# Altium schematic sheet User_Interface.SchDoc: User Interface
size A4; DocumentNumber: 14; SheetNumber: 14; SheetTotal: 51
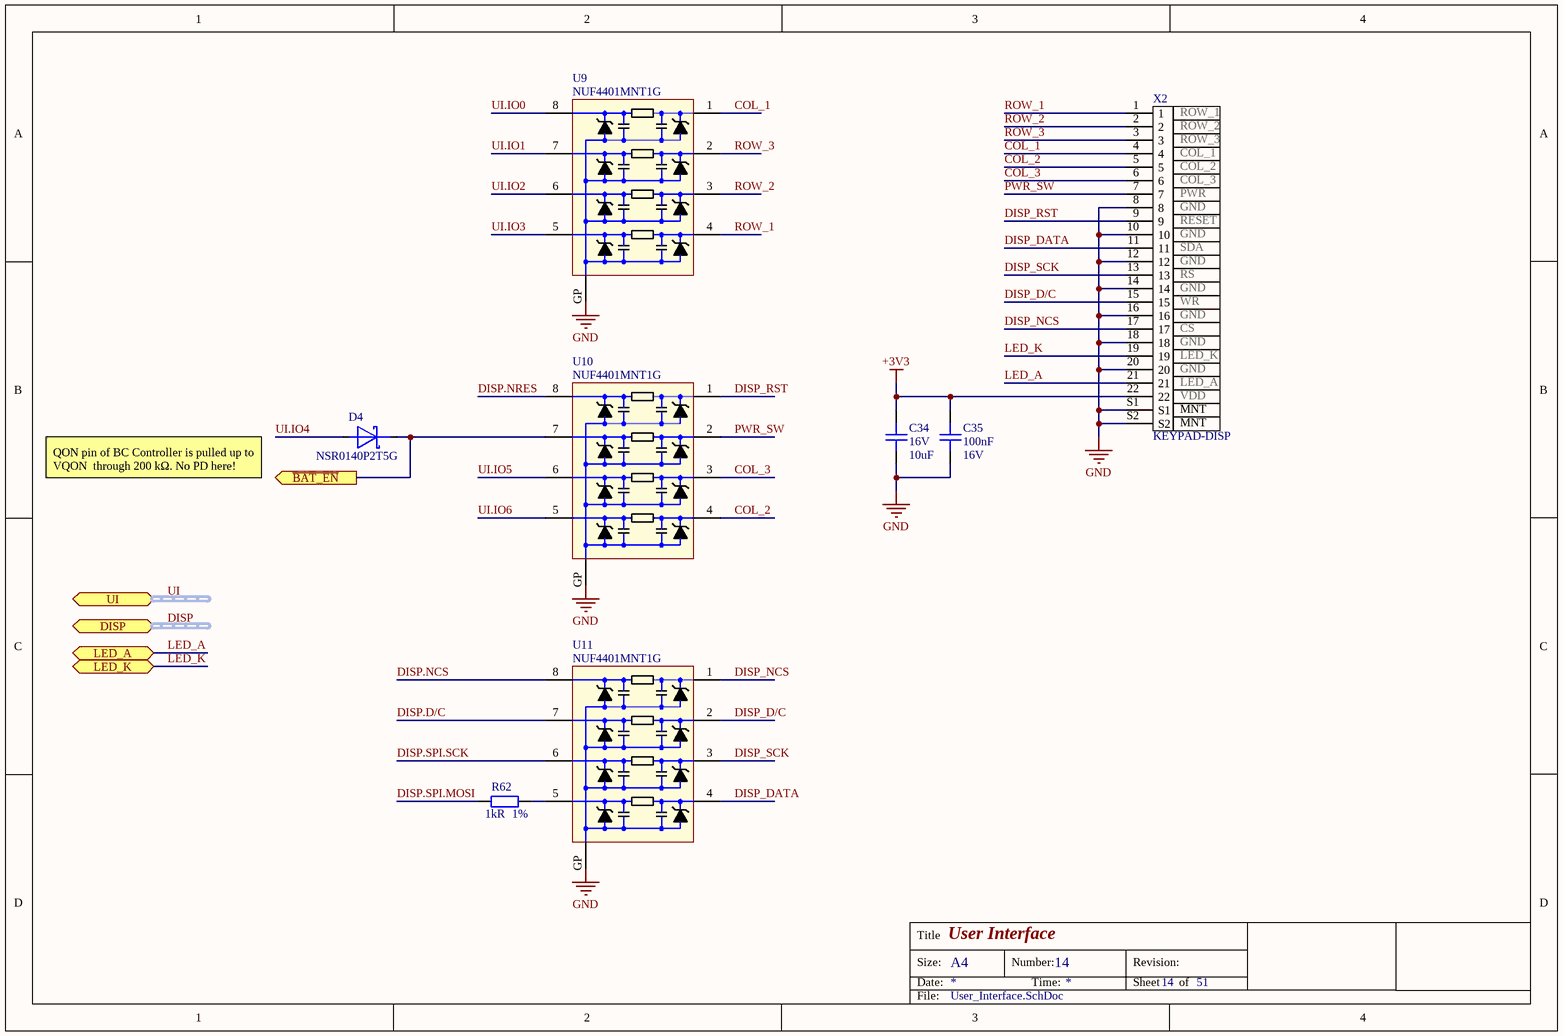
[diagram p0: User_Interface.SchDoc]

## Parts
C34  Voltage Rating: 16V  Capacitance: 10uF  [C0603]  (hidden comment: CAP CER 10UF 16V X5R 0603)
C35  Capacitance: 100nF  Voltage: 16V  [C0402]  (hidden comment: CAP CER 0.1UF 16V X7R 0402)
D4  NSR0140P2T5G  [SODFL100X40-2N]
R62  Tolerance: 1%  Resistance: 1kR  [R0402]  (hidden comment: RES SMD 1K OHM 1% 1/16W 0402)
U9  NUF4401MNT1G  [DFN8]
U10  NUF4401MNT1G  [DFN8]
U11  NUF4401MNT1G  [DFN8]
X2  KEYPAD-DISP  pin_1: ROW_1  pin_2: ROW_2  pin_3: ROW_3  pin_4: COL_1  pin_5: COL_2  pin_6: COL_3  pin_7: PWR  pin_8: GND  pin_9: RESET  pin_11: SDA  pin_13: RS  pin_15: WR  pin_17: CS  pin_19: LED_K  pin_21: LED_A  pin_22: VDD  pin_23: MNT  [CONN_0525592253]

## Ports
DISP (harness DISP_SPI), LED_A, LED_K, UI (harness GPIO), ~{BAT_EN} (out)

## Nets
+3V3: C34.1 C35.1 X2.22
GND: C34.2 C35.2 U9.GP(GND) U10.GP(GND) U11.GP(GND) X2.8 X2.10 X2.12 X2.14 X2.16 X2.18 X2.20 X2.S1 X2.S2
~{BAT_EN}: D4.1(K) U10.7(OUT2) ; port ~{BAT_EN}
COL_1: U9.1(INP1) X2.4
COL_2: U10.4(INP4) X2.5
COL_3: U10.3(INP3) X2.6
DISP.D/C: U11.7(OUT2)
DISP.NCS: U11.8(OUT1)
DISP.NRES: U10.8(OUT1)
DISP.SPI.MOSI: R62.1
DISP.SPI.SCK: U11.6(OUT3)
DISP_D/C: U11.2(INP2) X2.15
DISP_DATA: U11.4(INP4) X2.11
DISP_NCS: U11.1(INP1) X2.17
DISP_RST: U10.1(INP1) X2.9
DISP_SCK: U11.3(INP3) X2.13
LED_A: X2.21 ; port LED_A
LED_K: X2.19 ; port LED_K
PWR_SW: U10.2(INP2) X2.7
ROW_1: U9.4(INP4) X2.1
ROW_2: U9.3(INP3) X2.2
ROW_3: U9.2(INP2) X2.3
UI.IO0: U9.8(OUT1)
UI.IO1: U9.7(OUT2)
UI.IO2: U9.6(OUT3)
UI.IO3: U9.5(OUT4)
UI.IO4: D4.2(A)
UI.IO5: U10.6(OUT3)
UI.IO6: U10.5(OUT4)
NetR62_2: R62.2 U11.5(OUT4)

## Buses and harness runs
harness DISP = port DISP
harness UI = port UI

## Notes on the sheet
- QON pin of BC Controller is pulled up to VQON  through 200 kΩ. No PD here!
- Title
- Size:
- Date:
- A4
- Number:
- Time:
- Revision:
- Sheet
- of
- File:

## Library data of the parts
C34 = CAP CER 10UF 16V X5R 0603: 10µF ±10% 16V Ceramic Capacitor X5R 0603 (1608 Metric); Manufacturer: Murata; Manufacturer Part Number: GRM188R61C106KAALJ; Supplier 1: Digi-Key; Stock 1: 5470; Pricing 1: 1=0.39, 10=0.271, 100=0.1628, 500=0.1221, 1000=0.1031, 2500=0.0977, 5000=0.0923 (USD); Mount: Surface Mount; Case Code (Imperial): 0603; Case Code (Metric): 1608; Min Operating Temperature: -55°C; Max Operating Temperature: 85°C; Voltage Rating (DC): 16V; Tolerance: 10%; Packaging: Tape and Reel; Package Quantity: 10000; Dielectric: X5R; Termination: SMD/SMT; Composition: Ceramic; Length: 0.063inch; Height: 0.8mm; Width: 0.031inch; Thickness: 0.037inch; Supplier Part Number 1: 490-12736-1-ND; Case/Package: 0603; Weight: 0.000222oz
C35 = CAP CER 0.1UF 16V X7R 0402: 0.1µF ±10% 16V Ceramic Capacitor X7R 0402 (1005 Metric); Manufacturer Part Number: CC0402KRX7R7BB104; Manufacturer: Yageo; Revision: July-2002: Re-released for DXP Platform.; Order: CC0402KRX7R7BB104; Supplier 1: Digi-Key; Stock 1: 25916830; Pricing 1: 1=0.1, 10=0.031, 100=0.0136, 500=0.0097, 1000=0.0077, 2500=0.007, 5000=0.0064 (USD); Mount: Surface Mount; Number of Pins: 2; Case Code (Metric): 1005; Case Code (Imperial): 0402; Min Operating Temperature: -55°C; Max Operating Temperature: 125°C; Tolerance: 10%; Dielectric: X7R; Voltage Rating: 16V; Voltage Rating (DC): 16V; Packaging: Tape and Reel; Package Quantity: 1; Termination: SMD/SMT; Composition: Ceramic; Length: 1mm; Height: 0.5mm; Width: 0.02inch; Thickness: 0.022inch; Depth: 0.5mm; Radiation Hardening: No; REACH SVHC: No SVHC; Lead Free: Lead Free; Halogen Free: Halogen Free; ComponentLink1URL: http://www.yageo.com/documents/recent/UPY-GPHC_X7R_6.3V-to-50V_8.pdf?src-supplier=Avnet+Europe; ComponentLink1Description: http://www.yageo.com/documents/recent/UPY-GPHC_X7R_6.3V-to-50V_8.pdf?src-supplier=Avnet+Europe; ComponentLink2URL: http://www.yageo.com/documents/recent/UPY-GPHC_X7R_6.3V-to-50V_18.pdf?src-supplier=Digi-Key; ComponentLink2Description: http://www.yageo.com/documents/recent/UPY-GPHC_X7R_6.3V-to-50V_18.pdf?src-supplier=Digi-Key; ComponentLink3URL: http://www.yageo.com/documents/recent/UPY-GPHC_X7R_6.3V-to-50V_8.pdf?src-supplier=Avnet; ComponentLink3Description: http://www.yageo.com/documents/recent/UPY-GPHC_X7R_6.3V-to-50V_8.pdf?src-supplier=Avnet; ComponentLink4URL: http://www.yageo.com/documents/recent/UPY-GPHC_X7R_6.3V-to-50V_18.pdf?src-supplier=Mouser; ComponentLink4Description: http://www.yageo.com/documents/recent/UPY-GPHC_X7R_6.3V-to-50V_18.pdf?src-supplier=Mouser; ComponentLink5URL: http://www.farnell.com/datasheets/2167236.pdf?src-supplier=Element14; ComponentLink5Description: http://www.farnell.com/datasheets/2167236.pdf?src-supplier=Element14; ComponentLink6URL: http://www.farnell.com/datasheets/1489800.pdf?src-supplier=Element14; ComponentLink6Description: http://www.farnell.com/datasheets/1489800.pdf?src-supplier=Element14; Supplier Part Number 1: 311-1338-1-ND
D4 = DIODE SCHOTTKY 30V 70MA SOD923: Diode Schottky 30V 70mA (DC) Surface Mount SOD-923; Manufacturer: ON Semiconductor; Forward Voltage: 350mV; Max Surge Current: 500mA; Max Power Dissipation: 100mW; Max Reverse Leakage Current: 500nA; Element Configuration: Single; Supplier 1: Digi-Key; Manufacturer Part Number: NSR0140P2T5G; Stock 1: 28802; Pricing 1: 1=0.36, 10=0.27, 25=0.2368, 100=0.1284, 500=0.1048, 1000=0.0777, 2500=0.0683 (USD); Case/Package: SOD-923-2; Number of Pins: 2; Contact Plating: Tin,Matte; Min Operating Temperature: -55°C; Max Operating Temperature: 125°C; Forward Current: 70mA; Package Quantity: 1; Packaging: Tape and Reel; Average Rectified Current: 70mA; Max Repetitive Reverse Voltage (Vrrm): 30V; Peak Reverse Current: 500nA; Power Dissipation: 100mW; Peak Non-Repetitive Surge Current: 500mA; Max Forward Surge Current (Ifsm): 500mA; Termination: SMD/SMT; Max Reverse Voltage (DC): 30V; Length: 0.85mm; Height: 0.43mm; Width: 0.65mm; Radiation Hardening: No; REACH SVHC: No SVHC; Lead Free: Lead Free; ComponentLink1URL: http://www.onsemi.com/pub_link/Collateral/NSR0140P2-D.PDF?src-supplier=Future+Electronics; ComponentLink1Description: http://www.onsemi.com/pub_link/Collateral/NSR0140P2-D.PDF?src-supplier=Future+Electronics; ComponentLink2URL: http://www.farnell.com/datasheets/2353885.pdf?src-supplier=Newark; ComponentLink2Description: http://www.farnell.com/datasheets/2353885.pdf?src-supplier=Newark; ComponentLink3URL: http://www.farnell.com/datasheets/86281.pdf?src-supplier=Element14; ComponentLink3Description: http://www.farnell.com/datasheets/86281.pdf?src-supplier=Element14; ComponentLink4URL: http://www.onsemi.com/pub/Collateral/NSR0140P2-D.PDF?src-supplier=Avnet; ComponentLink4Description: http://www.onsemi.com/pub/Collateral/NSR0140P2-D.PDF?src-supplier=Avnet; ComponentLink5URL: http://www.onsemi.com/pub/Collateral/NSR0140P2-D.PDF?src-supplier=Digi-Key; ComponentLink5Description: http://www.onsemi.com/pub/Collateral/NSR0140P2-D.PDF?src-supplier=Digi-Key; ComponentLink6URL: http://www.mouser.com/ds/2/308/NSR0140P2-D-115172.pdf?src-supplier=Mouser; ComponentLink6Description: http://www.mouser.com/ds/2/308/NSR0140P2-D-115172.pdf?src-supplier=Mouser; Supplier Part Number 1: NSR0140P2T5GOSCT-ND; Mount: Surface Mount
R62 = RES SMD 1K OHM 1% 1/16W 0402: 1 kOhms ±1% 0.063W, 1/16W Chip Resistor 0402 (1005 Metric) Moisture Resistant Thick Film; Manufacturer: Yageo; Manufacturer Part Number: RC0402FR-071KL; Temperature Coefficient: 100ppm/°C; Power Rating: 62.5mW; Voltage Rating: 50V; Supplier 1: Digi-Key; Stock 1: 9574509; Pricing 1: 1=0.1, 10=0.015, 100=0.0062, 1000=0.0028, 2500=0.0024, 5000=0.002 (USD); Case/Package: 0402; Number of Pins: 2; Case Code (Imperial): 0402; Case Code (Metric): 1005; Min Operating Temperature: -55°C; Max Operating Temperature: 155°C; Packaging: Tape and Reel; Composition: Thick Film; Voltage Rating (DC): 50V; Termination: SMD/SMT; Military Standard: Not; Length: 1mm; Height: 0.32mm; Width: 0.5mm; Depth: 0.5mm; REACH SVHC: Unknown; Lead Free: Lead Free; ComponentLink1URL: http://www.mouser.com/ds/2/447/PYu-RC0402_51_RoHS_L_6_r-8721.pdf?src-supplier=Mouser; ComponentLink1Description: http://www.mouser.com/ds/2/447/PYu-RC0402_51_RoHS_L_6_r-8721.pdf?src-supplier=Mouser; ComponentLink2URL: http://documents.rs-components.com/techlib://itc_doclist_GB.htm?stockno=6186122&src-supplier=RSComponents; ComponentLink2Description: http://documents.rs-components.com/techlib://itc_doclist_GB.htm?stockno=6186122&src-supplier=RSComponents; ComponentLink3URL: http://www.farnell.com/datasheets/1018594.pdf?src-supplier=Element14; ComponentLink3Description: http://www.farnell.com/datasheets/1018594.pdf?src-supplier=Element14; ComponentLink4URL: http://www.yageo.com/documents/recent/PYu-RC0402_51_RoHS_L_6_r.pdf?src-supplier=Future+Electronics; ComponentLink4Description: http://www.yageo.com/documents/recent/PYu-RC0402_51_RoHS_L_6_r.pdf?src-supplier=Future+Electronics; ComponentLink5URL: http://www.farnell.com/datasheets/2167052.pdf?src-supplier=Element14; ComponentLink5Description: http://www.farnell.com/datasheets/2167052.pdf?src-supplier=Element14; Supplier Part Number 1: 311-1.00KLRCT-ND; Mount: Surface Mount
U9-U11 = FILTER RC(PI) 200 OHM/15PF SMD: EMI filter w/ ESD prot. NUF4401MN 12mm r; Manufacturer: ON Semiconductor; Number of Channels: 4; Frequency: 2.4GHz; Capacitance: 15pF; Number of Elements: 8; Resistance: 200R; Attenuation Value: 35dB; ESD Protection: Yes; Max DC Current: 100nA; DC Resistance (DCR): 230R; Test Frequency: 125MHz; Shielding: Unshielded; Supplier 1: Digi-Key; Manufacturer Part Number: NUF4401MNT1G; Stock 1: 2896; Pricing 1: 1=0.49, 10=0.45, 25=0.4296, 50=0.4158, 100=0.4019, 250=0.3812, 500=0.3188, 1000=0.2474 (USD); Case/Package: DFN; Min Operating Temperature: -40°C; Max Operating Temperature: 85°C; Packaging: Tape and Reel; ComponentLink1URL: http://www.onsemi.com/pub/Collateral/NUF4401MN-D.PDF?src-supplier=Digi-Key; ComponentLink1Description: http://www.onsemi.com/pub/Collateral/NUF4401MN-D.PDF?src-supplier=Digi-Key; ComponentLink2URL: http://www.onsemi.com/pub/Collateral/NUF4401MN-D.PDF?src-supplier=Avnet; ComponentLink2Description: http://www.onsemi.com/pub/Collateral/NUF4401MN-D.PDF?src-supplier=Avnet; ComponentLink3URL: http://www.onsemi.com/pub_link/Collateral/NUF4401MN-D.PDF?src-supplier=Avnet+Europe; ComponentLink3Description: http://www.onsemi.com/pub_link/Collateral/NUF4401MN-D.PDF?src-supplier=Avnet+Europe; ComponentLink4URL: http://www.mouser.com/ds/2/308/NUF4401MN-D-100381.pdf?src-supplier=Mouser; ComponentLink4Description: http://www.mouser.com/ds/2/308/NUF4401MN-D-100381.pdf?src-supplier=Mouser; Supplier Part Number 1: 488-NUF4401MNT1GCT-ND; Number of Pins: 8; Contact Plating: Tin,Matte; Package Quantity: 1; Circuit Type: Filter; Termination: Flat; Number of Lines: 4; Length: 2mm; Height: 1mm; Width: 0.079inch; Depth: 2mm; Radiation Hardening: No; Lead Free: Lead Free; Halogen Free: Halogen Free; Mount: Surface Mount
X2 = CONN 0525592253 FFC VERT 22POS 0.50MM SMD: 22 Position FFC, FPC Connector Contacts, Vertical - 1 Sided 0.020" (0.50mm) Surface Mount; Manufacturer: Molex; Manufacturer Part Number: 52559-2253; Current Rating: 500mA; Voltage Rating: 50V; Number of Positions: 22; Gender: Receptacle; Pitch: 0.5mm; Supplier 1: Digi-Key; Stock 1: 4369; Pricing 1: 1=2.66, 10=2.267, 100=1.8728 (USD); Mount: Surface Mount; Contact Plating: Gold; Contact Material: Bronze; Housing Material: Nylon; Number of Rows: 1; Package Quantity: 1000; Packaging: Tape and Reel; Termination: SMD/SMT; Number of Contacts: 22; Orientation: Vertical; Series: 52559; Number of Circuits: 22; REACH SVHC: Unknown; ComponentLink1URL: http://www.farnell.com/datasheets/1896633.pdf?src-supplier=Element14; ComponentLink1Description: http://www.farnell.com/datasheets/1896633.pdf?src-supplier=Element14; ComponentLink2URL: http://www.mouser.com/ds/2/276/0525592253_FFC_FPC_CONNECTORS-229826.pdf?src-supplier=Mouser; ComponentLink2Description: http://www.mouser.com/ds/2/276/0525592253_FFC_FPC_CONNECTORS-229826.pdf?src-supplier=Mouser; Supplier Part Number 1: WM10988CT-ND; pin_10: GND; pin_12: GND; pin_14: GND; pin_16: GND; pin_18: GND; pin_20: GND; pin_24: MNT